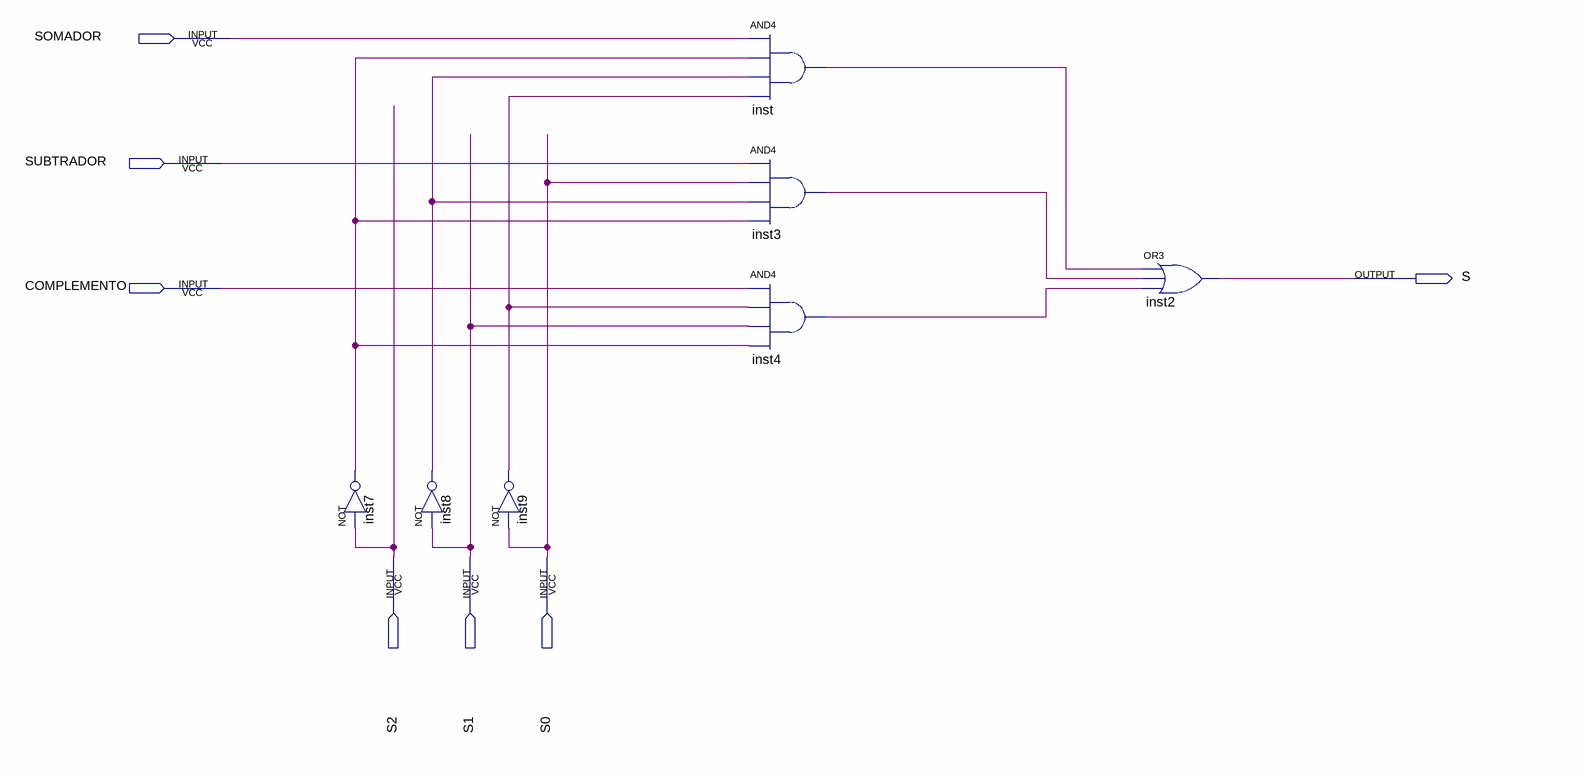
[diagram p0: schematic sheet]
// Quartus schematic MUXOVERFLOW.bdf as structural Verilog: 7 symbols, 7 pins
module MUXOVERFLOW (
  input  SOMADOR,
  input  SUBTRADOR,
  input  COMPLEMENTO,
  input  S2,
  input  S1,
  input  S0,
  output S
);

  wire inst3_out, inst4_out, inst7_out, inst8_out, inst9_out, inst_out;

  not inst7 (inst7_out, S2);
  not inst8 (inst8_out, S1);
  not inst9 (inst9_out, S0);
  and inst (inst_out, SOMADOR, inst7_out, inst8_out, inst9_out);
  and inst3 (inst3_out, SUBTRADOR, S0, inst8_out, inst7_out);
  and inst4 (inst4_out, COMPLEMENTO, inst9_out, S1, inst7_out);
  or inst2 (S, inst_out, inst3_out, inst4_out);
endmodule
